# Altium schematic sheet D.SchDoc
size A
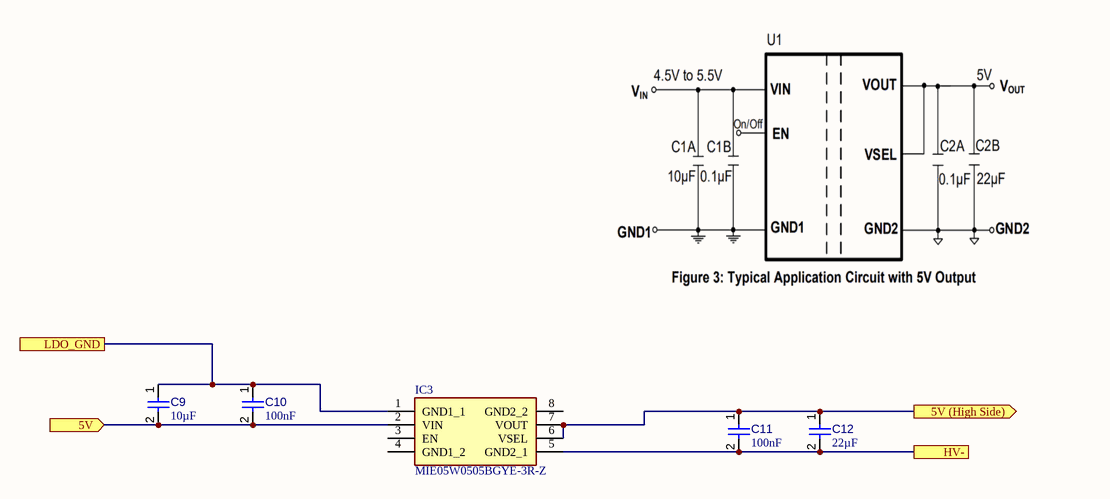
[diagram p0: D.SchDoc]

## Parts
C9  value 10µF  [CAPC2013X135X45NL10T25]  (hidden comment: Capacitor 10 uF +/- 10% 16 V 0805)
C10  value 100nF  [CAPC2013X95X50LL10T25]  (hidden comment: Capacitor 100 nF +/-10% 50 V 0805)
C11  value 100nF  [CAPC2013X95X50LL10T25]  (hidden comment: Capacitor 100 nF +/-10% 50 V 0805)
C12  value 22µF  [CAPC0805(2012)145_L]  (hidden comment: Capacitor 22µF +/-40% 16V 0805)
IC3  MIE05W0505BGYE-3R-Z  [SOIC127P1030X265-8N]

## Ports
5V (High Side) (out), 5V (in), HV-, LDO_GND

## Nets
5V: C9.2 C10.2 IC3.2(VIN) ; port 5V
5V (High Side): C11.1 C12.1 IC3.6(VSEL) IC3.7(VOUT) ; port 5V (High Side)
HV-: C11.2 C12.2 IC3.5(GND2_1) ; port HV-
LDO_GND: C9.1 C10.1 IC3.1(GND1_1) ; port LDO_GND

Not connected (* = marked no-connect by the designer): IC3 3(EN) 4(GND1_2) 8(GND2_2)

## Library data of the parts
C9 = CMP-001-00015-6: Chip Capacitor, 10 uF, +/- 10%, 16 V, 0805 (2012 Metric); Voltage Rating: 16V; Capacitor Type: Ceramic; RoHS Compliant: True; Max Operating Temperature: 85°C; Min Operating Temperature: -55°C; Mounting Technology: SM; Tolerance: 10%; Case/Package: 0805; Pins: 2
C10 C11 = CMP-001-00018-6: Chip Capacitor, 100 nF, +/- 10%, 50 V, 0805 (2012 Metric); Capacitor Type: Ceramic; Voltage Rating: 50V; Pins: 2; Max Operating Temperature: 125°C; Min Operating Temperature: -55°C; Mounting Technology: SM; Case/Package: 0805; RoHS Compliant: True; Tolerance: 10%
C12 = CMP-001-00081-4: Chip Capacitor, 22µF +/-40%, 16V, 0805, Thickness 1.45 mm; Tolerance: 5%; Voltage Rating: 16V; Mounting Technology: SMT; Pins: 2; Max Operating Temperature: 85°C; Case/Package: 0805; Min Operating Temperature: -55°C
IC3 = MIE05W0505BGYE-3R-Z: Integrated Circuit; Manufacturer_Name: Monolithic Power Systems (MPS); Datasheet Link: https://www.monolithicpower.com/en/documentview/productdocument/index/version/2/document_type/Datasheet/lang/en/sku/MIE05W0505BGYE/document_id/11798/; Height: 2.65mm; Manufacturer_Part_Number: MIE05W0505BGYE-3R-Z